# EAGLE design ArduinoFio (EAGLE 7.5.0)
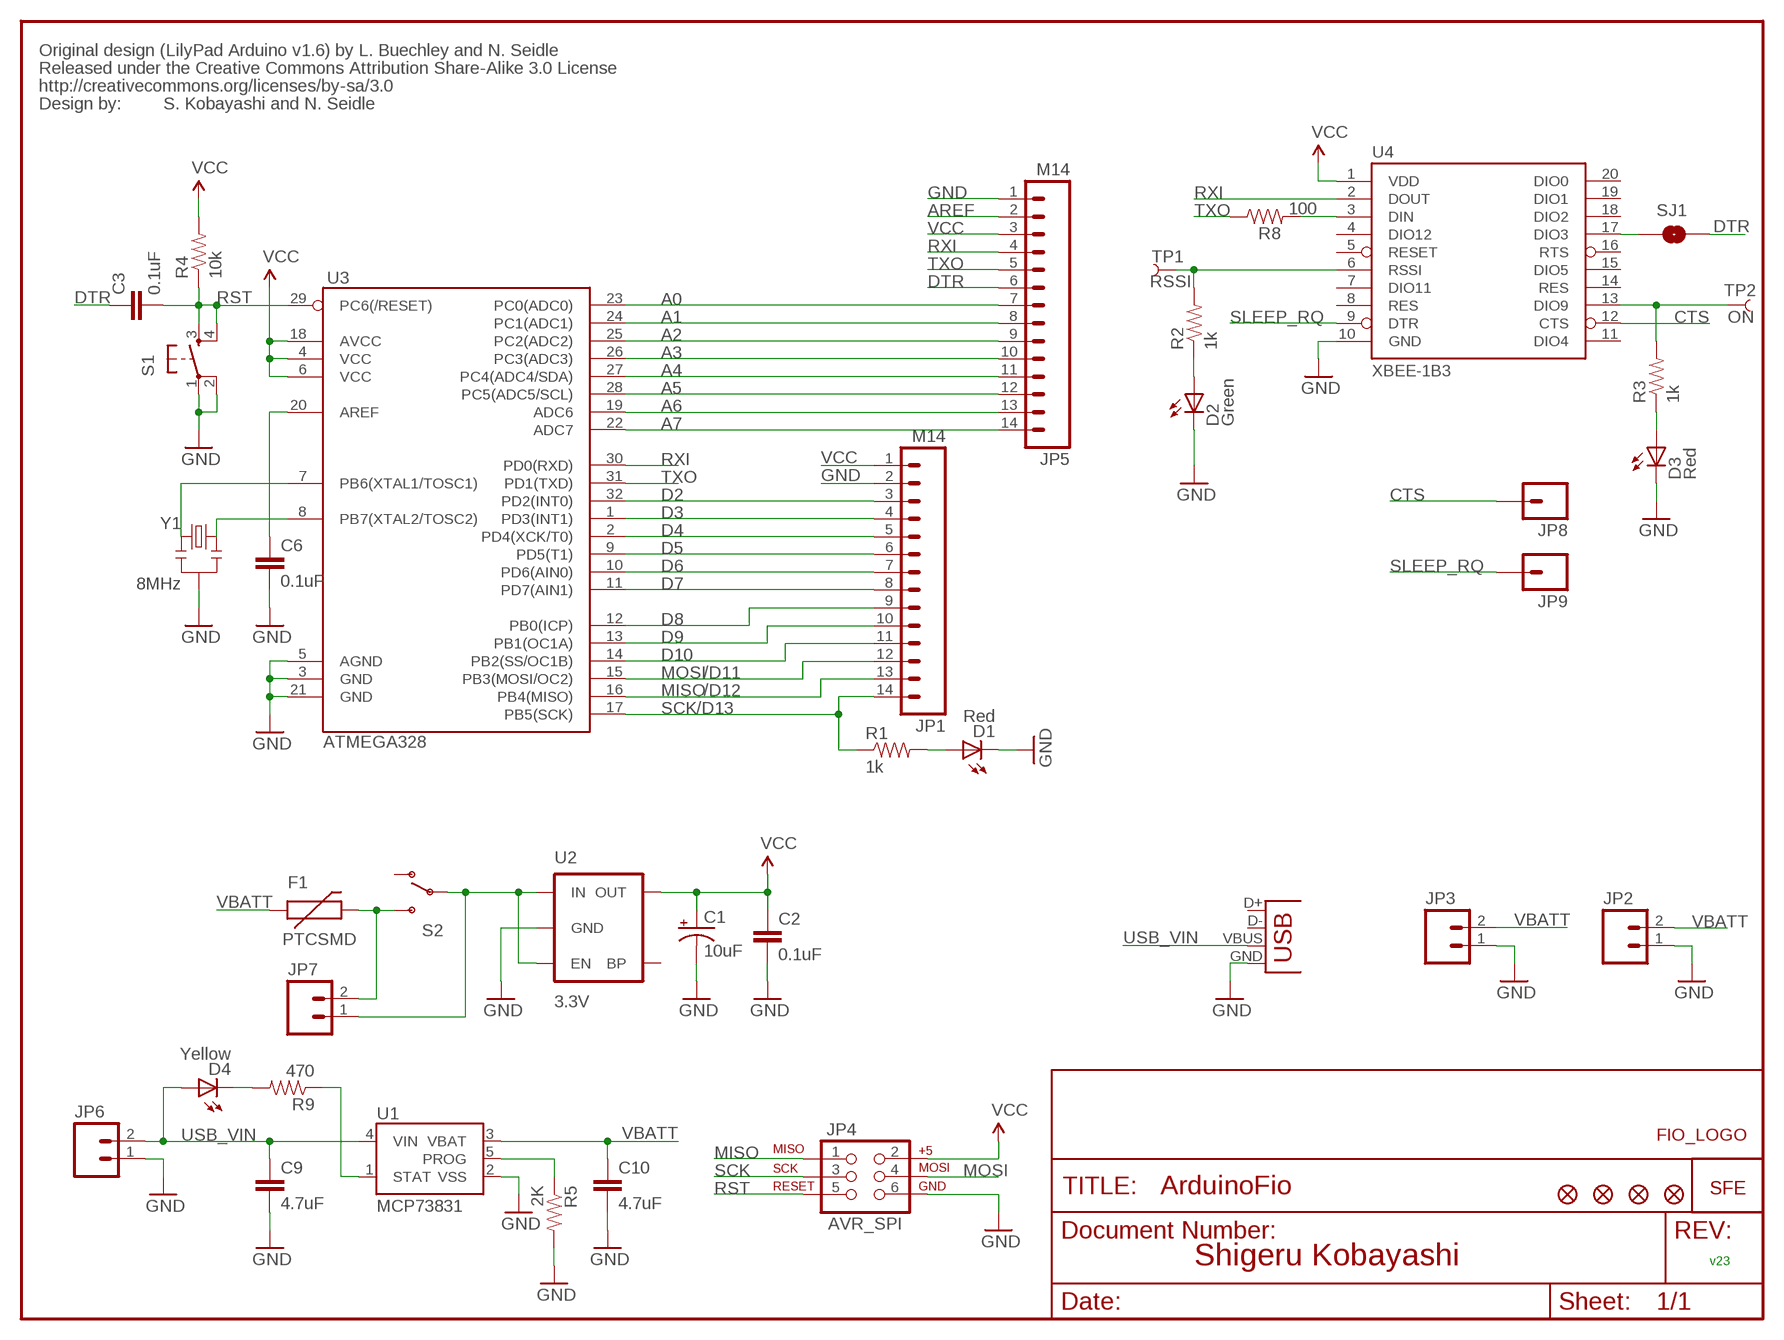
[diagram p0: schematic, sheet 1]

## Parts
C1  10uF  CAP_POL1206  [EIA3216]
C2  0.1uF  CAP0402-CAP  [0402-CAP]
C3  0.1uF  CAP0402-CAP  [0402-CAP]
C6  0.1uF  CAP0402-CAP  [0402-CAP]
C9  4.7uF  CAP0402-CAP  [0402-CAP]
C10  4.7uF  CAP0402-CAP  [0402-CAP]
D1  Red  LED0603  [LED-0603]
D2  Green  LED0603  [LED-0603]
D3  Red  LED0603  [LED-0603]
D4  Yellow  LED0603  [LED-0603]
F1  PTCSMD  [PTC-1206]
FD1  FIDUCIAL1X2  [FIDUCIAL-1X2]
FD2  FIDUCIAL1X2  [FIDUCIAL-1X2]
JP1  M14  [1X14]
JP2  M02PTH  [1X02]
JP3  M02-JST-2MM-SMT  [JST-2-SMD]
JP4  AVR_SPI  AVR_SPI_PRG_6PTH  [2X3]
JP5  M14  [1X14]
JP6  M02PTH  [1X02]
JP7  M02PTH  [1X02]
JP8  M01PTH  [1X01]
JP9  M01PTH  [1X01]
R1  1k  RESISTOR0402-RES  [0402-RES]
R2  1k  RESISTOR0402-RES  [0402-RES]
R3  1k  RESISTOR0402-RES  [0402-RES]
R4  10k  RESISTOR0402-RES  [0402-RES]
R5  2K  RESISTOR0402-RES  [0402-RES]
R8  100  RESISTOR0402-RES  [0402-RES]
R9  470  RESISTOR0402-RES  [0402-RES]
S1  TAC_SWITCHSMD  [TACTILE_SWITCH_SMD]
S2  SWITCH-SPSTSMD  [AYZ0202]
SJ1  SOLDERJUMPERNC  [SJ_2S]
TP1  RSSI  TEST-POINT3X5  [PAD.03X.05]
TP2  ON  TEST-POINT3X5  [PAD.03X.05]
U1  MCP73831  MCP73831SMD  [SOT23-5]
U2  3.3V  V_REG_LDOSMD  [SOT23-5]
U3  ATMEGA328  ATMEGA168  [TQFP32-08]
U4  XBEE-1B3  [XBEE-SMD]
U$1  LOGO-SFENEW  [SFE-NEW-WEBLOGO]
U$3  CREATIVE_COMMONS  [CREATIVE_COMMONS]
U$4  FIDUCIAL1X2  [FIDUCIAL-1X2]
U$5  FIDUCIAL1X2  [FIDUCIAL-1X2]
U$6  FIO_LOGOV2  [FUNNEL_LOGO_BOTTOM_V2]
X1  USBSMD  [USB-MINIB]
Y1  8MHz  RESONATORSMD  [RESONATOR-SMD]

## Nets
A0: JP5.7 U3.23(PC0(ADC0))
A1: JP5.8 U3.24(PC1(ADC1))
A2: JP5.9 U3.25(PC2(ADC2))
A3: JP5.10 U3.26(PC3(ADC3))
A4: JP5.11 U3.27(PC4(ADC4/SDA))
A5: JP5.12 U3.28(PC5(ADC5/SCL))
A6: JP5.13 U3.19(ADC6)
A7: JP5.14 U3.22(ADC7)
AREF: C6.1 JP5.2 U3.20(AREF)
CTS: JP8.1 U4.12(CTS)
D2: JP1.3 U3.32(PD2(INT0))
D3: JP1.4 U3.1(PD3(INT1))
D4: JP1.5 U3.2(PD4(XCK/T0))
D5: JP1.6 U3.9(PD5(T1))
D6: JP1.7 U3.10(PD6(AIN0))
D7: JP1.8 U3.11(PD7(AIN1))
D8: JP1.9 U3.12(PB0(ICP))
D9: JP1.10 U3.13(PB1(OC1A))
D10: JP1.11 U3.14(PB2(SS/OC1B))
DTR: C3.1 JP5.6 SJ1.2
GND: C1.C(-) C2.2 C6.2 C9.2 C10.2 D1.C D2.C D3.C JP1.2 JP2.1 JP3.1 JP4.6 JP5.1 JP6.1 R5.2 S1.1 S1.2 U1.2(VSS) U2.2(GND) U3.3(GND) U3.5(AGND) U3.21(GND) U4.10(GND) X1.GND Y1.2
MISO: JP1.13 JP4.1 U3.16(PB4(MISO))
MOSI: JP1.12 JP4.4 U3.15(PB3(MOSI/OC2))
N$1: R3.2 TP2.P$1 U4.13(DIO9)
N$2: D1.A R1.2
N$3: D2.A R2.1
N$4: R2.2 TP1.P$1 U4.6(RSSI)
N$5: JP7.1 S2.2(P) U2.1(IN) U2.3(EN)
N$6: D3.A R3.1
N$7: R8.2 U4.3(DIN)
N$8: D4.C R9.2
N$9: F1.2 JP7.2 S2.3(S)
N$10: U3.7(PB6(XTAL1/TOSC1)) Y1.3
N$11: R5.1 U1.5(PROG)
N$12: U3.8(PB7(XTAL2/TOSC2)) Y1.1
N$13: SJ1.1 U4.17(DIO3)
N$14: R9.1 U1.1(STAT)
RST: C3.2 JP4.5 R4.1 S1.3 S1.4 U3.29(PC6(/RESET))
RXI: JP5.4 U3.30(PD0(RXD)) U4.2(DOUT)
SCK: JP1.14 JP4.3 R1.1 U3.17(PB5(SCK))
SLEEP_RQ: JP9.1 U4.9(DTR)
TXO: JP5.5 R8.1 U3.31(PD1(TXD))
USB_VIN: C9.1 D4.A JP6.2 U1.4(VIN) X1.VBUS
VBATT: C10.1 F1.1 JP2.2 JP3.2 U1.3(VBAT)
VCC [VCC]: C1.A(+) C2.1 JP1.1 JP4.2 JP5.3 R4.2 U2.5(OUT) U3.4(VCC) U3.6(VCC) U3.18(AVCC) U4.1(VDD)
Unconnected: S2.1(O) U2.4(BP) U4.4(DIO12) U4.5(RESET) U4.7(DIO11) U4.8(RES) U4.11(DIO4) U4.14(RES) U4.15(DIO5) U4.16(RTS) U4.18(DIO2) U4.19(DIO1) U4.20(DIO0) X1.D+ X1.D-

## Notes on the sheet
- Original design (LilyPad Arduino v1.6) by L. Buechley and N. Seidle
- S. Kobayashi and N. Seidle
- /D11
- /D12
- /D13
- Shigeru Kobayashi | v23

## Library data of the parts
C1 = SparkFun:CAP_POL: Capacitor Polarized These are standard SMD and PTH capacitors. Normally 10uF, 47uF, and 100uF in electrolytic and tantalum varieties. Always verify the external diameter of the through hole cap, it varies with capacity, voltage, and manufacturer. The EIA devices should be standard.
C2 C3 C6 C9 C10 = SparkFun:CAP: Capacitor Standard 0603 ceramic capacitor, and 0.1" leaded capacitor.
D1-D4 = SparkFun:LED: LEDs Standard schematic elements and footprints for 5mm, 3mm, 1206, and 0603 sized LEDs. 5mm - Spark Fun Electronics SKU : COM-00529 (and others)
F1 = SparkFun:PTC: Resettable Fuse PTC Resettable Fuse. Spark Fun Electronics SKU : COM-08357
FD1 FD2 = SparkFun-Aesthetics:FIDUCIAL: Fiducial Alignment Points Various fiducial points for machine vision alignment.
JP1 JP5 = SparkFun:M14: Header 14 Standard 14-pin 0.1" header. Use with straight break away headers (SKU : PRT-00116), right angle break away headers (PRT-00553), swiss pins (PRT-00743), machine pins (PRT-00117), and female headers (PRT-00115).
JP2 JP3 JP6 JP7 = SparkFun:M02: Header 2 Standard 2-pin 0.1" header. Use with straight break away headers (SKU : PRT-00116), right angle break away headers (PRT-00553), swiss pins (PRT-00743), machine pins (PRT-00117), and female headers (PRT-00115). Molex polarized connector foot print use with SKU : PRT-08233 with associated crimp pins and housings.
JP4 = SparkFun:AVR_SPI_PRG_6: AVR ISP 6 Pin This is the reduced ISP connector for AVR programming. Common on Arduino. This footprint will take up less PCB space and can be used with a 10-pin to 6-pin adapter such as SKU: BOB-08508
JP8 JP9 = SparkFun:M01: Header 1 Standard 1-pin 0.1" header. Use with straight break away headers (SKU : PRT-00116), right angle break away headers (PRT-00553), swiss pins (PRT-00743), machine pins (PRT-00117), and female headers (PRT-00115).
R1-R5 R8 R9 = SparkFun:RESISTOR: Resistor Basic schematic elements and footprints for 0603, 1206, and PTH resistors.
S1 = SparkFun:TAC_SWITCH: Momentary Switch Button commonly used for reset or general input. Spark Fun Electronics SKU : COM-00097
S2 = SparkFun:SWITCH-SPST: SPST Switch Simple slide switch. Spark Fun Electronics SKU : COM-00102
SJ1 = SparkFun:SOLDERJUMPER: Solder Jumper Standard SMD solder jumper. Used to automate production. Two varients : Normally Open and Normally Closed are the same, but have different paste layers. NC will have a large amount of paste and should jumper during reflow.
TP1 TP2 = SparkFun:TEST-POINT
U1 = SparkFun:MCP73831
U2 = SparkFun:V_REG_LDO: Voltage Regulator LDO Standard 150mA LDO voltage regulator in SOT-23 layout. Micrel part MIC5205. BP (by-pass) pin is used to lower output noise with 470pF cap.
U3 = SparkFun:ATMEGA168
U4 = SparkFun:XBEE-1
U$1 = SparkFun:LOGO-SFE: Spark Fun Electronics PCB Logo This is the standard Spark Fun Electronics PCB logo.
U$3 = SparkFun:CREATIVE_COMMONS
U$4 U$5 = SparkFun:FIDUCIAL: Fiducial Alignment Points Various fiducial points for machine vision alignment.
U$6 = SparkFun:FIO_LOGO
X1 = SparkFun:USB: USB Connectors USB-B-PTH is fully proven SKU : PRT-00139 USB-miniB is fully proven SKU : PRT-00587 USB-A-PCB is untested. USB-A-H is throughly reviewed, but untested. Spark Fun Electronics SKU : PRT-00437 USB-B-SMT is throughly reviewed, but untested. Needs silkscreen touching up. USB-A-S has not been used/tested USB-MB-H has not been used/tested
Y1 = SparkFun:RESONATOR: Resonator Small SMD resonator. This is the itty bitty 10/20MHz resonators with built in caps. CSTCE10M0G55 and CSTCE20M0V53. Footprint has been reviewed closely but hasn't been tested yet.

## Net classes
0 Default: width 0.203 mm
1 VCC: width 0.381 mm
2 LEDPower: width 0.203 mm
3 ButtonSignal: width 0.203 mm

## Board
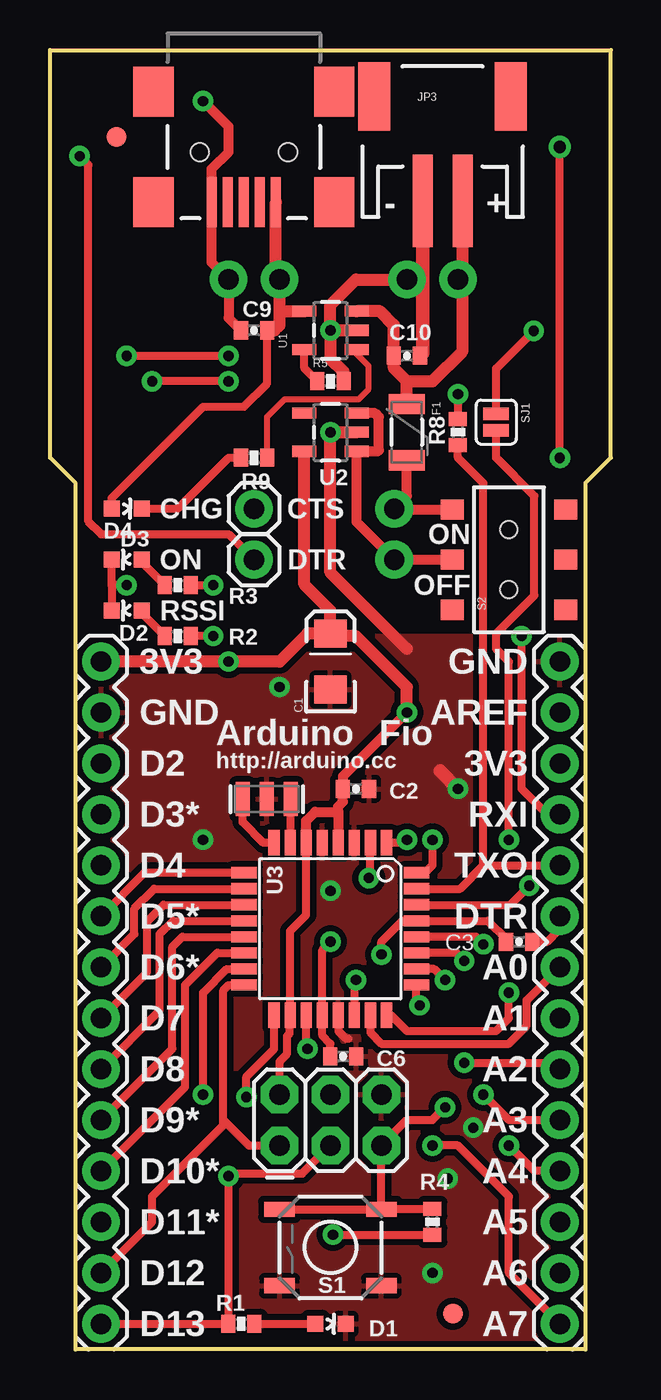
[diagram p1: board, top side]
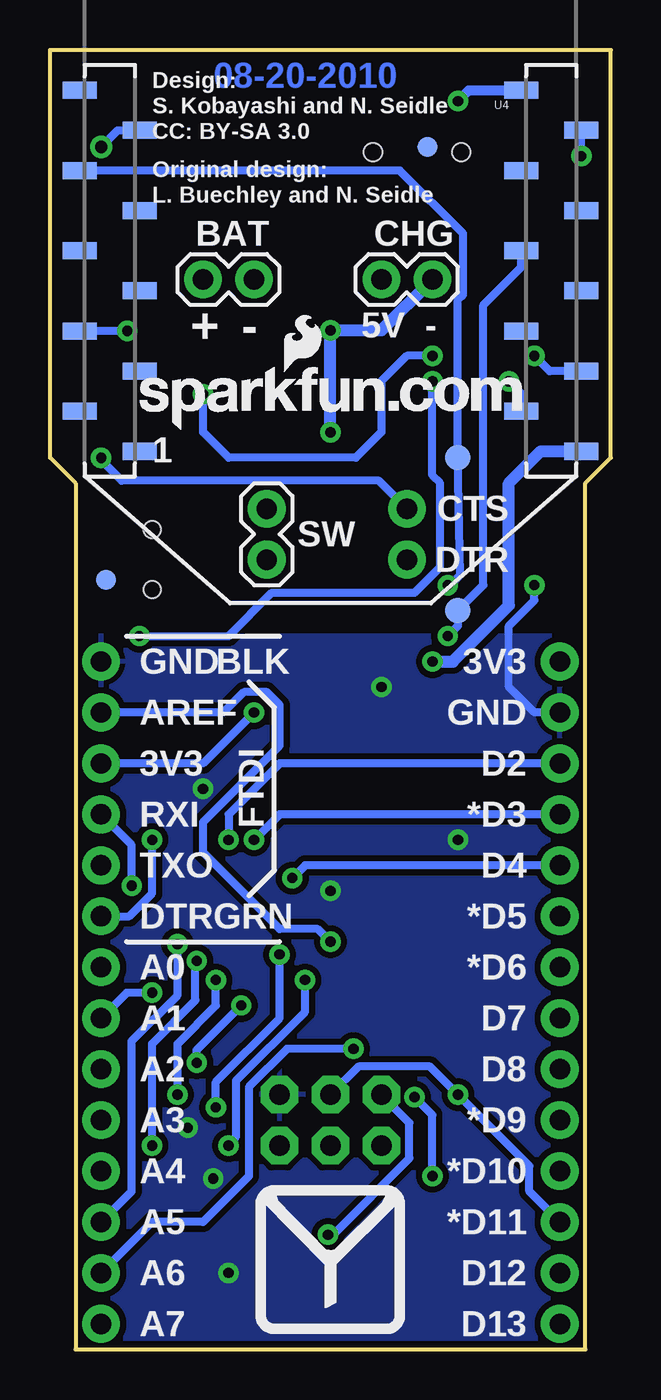
[diagram p2: board, bottom side, seen from below]

Size 27.94 x 64.77 mm. Coordinates in mm from the lower left corner, seen from the top.
Outline: 26.67,43.18 26.67,0 1.27,0 1.27,43.18 0,44.45 0,64.77 27.94,64.77 27.94,44.45 26.67,43.18
Copper layers (1*16): Top 0.035mm / dielectric 1.5mm / Bottom 0.035mm
Design rules "SparkFun": minimum track width 8mil, minimum drill 20mil, track to track 8mil, track to pad 8mil, pad to pad 8mil, via to via 8mil, smd to smd 8mil, copper to edge 8mil, drill to drill 8mil, minimum pad ring 12mil, minimum via ring 10mil, stop-mask expansion 4mil, vias tented up to drill 20mil, thermal gap 10mil

### Footprints (pad centres in the part's own frame; a part is rotated, then mirrored left to right if it is on the bottom)
EIA3216 = smd 1.4 x 1.6: A 1.4,0; C -1.4,0
0402-CAP = smd 0.7 x 0.9: 1 -0.65,0; 2 0.65,0
LED-0603 = smd 0.8 x 0.8: A 0,-0.75; C 0,0.75
PTC-1206 = smd 1 x 1.8: 1 -1.4,0; 2 1.4,0
FIDUCIAL-1X2 = smd 1 x 1: 1 0,0
1X14 = drill 1.016 pad 1.88: 1 0,0; 2 2.54,0; 3 5.08,0; 4 7.62,0; 5 10.16,0; 6 12.7,0; 7 15.24,0; 8 17.78,0; 9 20.32,0; 10 22.86,0; 11 25.4,0; 12 27.94,0; 13 30.48,0; 14 33.02,0
1X02 = drill 1.016 pad 1.88: 1 0,0; 2 2.54,0
JST-2-SMD = smd 1 x 4.6: 1 -1,-3.7; 2 1,-3.7 | smd 1.6 x 3.4: NC1 -3.4,1.5; NC2 3.4,1.5
2X3 = drill 1.016 pad 1.88 octagon: 1 0,0; 2 0,2.54; 3 2.54,0; 4 2.54,2.54; 5 5.08,0; 6 5.08,2.54
1X01 = drill 1.016 pad 1.88: 1 0,0
0402-RES = smd 0.7 x 0.9: 1 -0.65,0; 2 0.65,0
TACTILE_SWITCH_SMD = smd 1.524 x 0.762: 1 -2.54,1.905; 2 2.54,1.905; 3 -2.54,-1.905; 4 2.54,-1.905
AYZ0202 = smd 1 x 1.15: 1 -2.5,2.825; 2 0,2.825; 3 2.5,2.825; 4 -2.5,-2.825; 5 0,-2.825; 6 2.5,-2.825 | hole 0.85: 1.5,0; -1.5,0
SJ_2S = smd 0.635 x 1.27: 1 -0.412,0; 2 0.412,0
PAD.03X.05 = smd 1.27 x 1.27: P$1 0,0
SOT23-5 = smd 0.55 x 1.2: 1 -0.95,-1.3; 2 0,-1.3; 3 0.95,-1.3; 4 0.95,1.3; 5 -0.95,1.3
TQFP32-08 = smd 1.27 x 0.559: 1 -4.293,2.8; 2 -4.293,2; 3 -4.293,1.2; 4 -4.293,0.4; 5 -4.293,-0.4; 6 -4.293,-1.2; 7 -4.293,-2; 8 -4.293,-2.8; 17 4.293,-2.8; 18 4.293,-2; 19 4.293,-1.2; 20 4.293,-0.4; 21 4.293,0.4; 22 4.293,1.2; 23 4.293,2; 24 4.293,2.8 | smd 0.559 x 1.27: 9 -2.8,-4.293; 10 -2,-4.293; 11 -1.2,-4.293; 12 -0.4,-4.293; 13 0.4,-4.293; 14 1.2,-4.293; 15 2,-4.293; 16 2.8,-4.293; 25 2.8,4.293; 26 2,4.293; 27 1.2,4.293; 28 0.4,4.293; 29 -0.4,4.293; 30 -1.2,4.293; 31 -2,4.293; 32 -2.8,4.293
XBEE-SMD = smd 1.7 x 0.85: 1 -12.5,20; 2 -9.5,18; 3 -12.5,16; 4 -9.5,14; 5 -12.5,12; 6 -9.5,10; 7 -12.5,8; 8 -9.5,6; 9 -12.5,4; 10 -9.5,2; 11 12.5,2; 12 9.5,4; 13 12.5,6; 14 9.5,8; 15 12.5,10; 16 9.5,12; 17 12.5,14; 18 9.5,16; 19 12.5,18; 20 9.5,20
USB-MINIB = smd 2.5 x 0.5: D+ 2.5,0; D- 2.5,0.8; GND 2.5,-1.6; ID 2.5,-0.8; VBUS 2.5,1.6 | smd 2.5 x 2: MTN1 -3,4.5; MTN2 2.5,4.5; MTN3 -3,-4.5; MTN4 2.5,-4.5 | hole 0.9: 0,2.2; 0,-2.2
RESONATOR-SMD = smd 0.7 x 1.7: 1 -1.2,0; 2 0,0; 3 1.2,0

### Placement (x,y rotation side)
C1  13.97,34.29 90 top
C2  15.24,27.94 0 top
C3  23.37,20.32 180 top
C6  14.61,14.61 0 top
C9  10.16,50.8 180 top
C10  17.78,49.53 0 top
D1  13.97,1.27 270 top
D2  3.81,36.83 90 top
D3  3.81,39.37 90 top
D4  3.81,41.91 270 top
F1  17.78,45.72 270 top
FD1  25.15,38.35 0 bottom
FD2  9.14,59.94 0 bottom
JP1  2.54,34.29 270 top
JP2  17.78,53.34 180 bottom
JP3  19.56,60.96 0 top
JP4  11.43,10.16 0 top
JP5  25.4,34.29 270 top
JP6  8.89,53.34 180 bottom
JP7  17.14,39.37 90 bottom
JP8  10.16,41.91 0 top
JP9  10.16,39.37 0 top
R1  9.53,1.27 0 top
R2  6.35,35.56 0 top
R3  6.35,38.1 0 top
R4  19.05,6.35 270 top
R5  13.97,48.26 0 top
R8  20.32,45.72 90 top
R9  10.16,44.45 180 top
S1  13.97,5.08 180 top
S2  22.86,39.37 90 top
SJ1  22.22,46.23 270 top
TP1  7.62,36.83 0 bottom
TP2  7.62,44.45 0 bottom
U1  13.97,50.8 90 top
U2  13.97,45.72 90 top
U3  13.96,20.96 270 top
U4  13.97,64.77 180 bottom
U$1  23.5,45.85 0 bottom
U$3  -11.43,-8.89 0 top  (outside the outline)
U$4  20.07,1.78 0 top
U$5  3.3,60.45 0 top
U$6  13.97,4.45 0 top
X1  9.65,59.69 270 top
Y1  10.79,27.43 0 top

### Tracks (layer width: path | path; a pad name or v marks a point on that pad's centre or on a via)
A0
  Top 0.406: U3.23 15.96,15.79 16.51,15.24 22.86,15.24 23.75,16.13 23.75,17.4 JP5.7
A1  (via drill 0.51)
  Top 0.406: U3.24 16.98,16.67 17.78,15.88 22.22,15.88 22.86,16.51 v22.86,17.78
  Bottom 0.406: v22.86,17.78 24.13,17.78 JP5.8
A2  (via drill 0.51)
  Top 0.406: U3.25 18.25,17.31 v18.41,17.14 | v20.64,14.29 25.08,14.29 JP5.9
  Bottom 0.406: v18.41,17.14 20.64,14.92 v20.64,14.29
A3  (via drill 0.51)
  Top 0.406: U3.26 19.13,18.96 v19.68,18.41 | v21.59,12.7 22.86,11.43 JP5.10
  Bottom 0.406: v21.59,12.7 21.59,15.24 19.68,17.14 v19.68,18.41
A4  (via drill 0.51)
  Top 0.406: U3.27 20.24,19.77 v20.64,19.37 | v22.86,10.16 24.13,8.89 JP5.11
  Bottom 0.406: v22.86,10.16 22.86,15.24 20.7,17.4 20.7,19.3 v20.64,19.37
A5  (via drill 0.51)
  Top 0.406: U3.28 21.22,20.57 v21.59,20.19
  Bottom 0.406: v21.59,20.19 21.59,17.65 23.88,15.37 23.88,7.87 JP5.12
A6  (via drill 0.51)
  Top 0.406: U3.19 12.76,14.99 v12.83,14.99
  Bottom 0.406: JP5.13 22.86,6.35 20.32,6.35 18.03,8.64 18.03,13.08 16.13,14.99 v12.83,14.99
A7  (via drill 0.51)
  Top 0.406: U3.22 15.16,18.34 v15.24,18.41 | v19.05,10.16 20.32,10.16 22.86,7.62 22.86,3.81 JP5.14
  Bottom 0.406: v15.24,18.41 15.24,16.83 18.67,13.4 18.67,10.6 19.05,10.22 v19.05,10.16
AREF  (via drill 0.51)
  Top 0.406: C6.1 13.97,15.24 13.56,15.65 U3.20 13.56,19.91 v13.97,20.32
  Bottom 0.406: v13.97,20.32 14.61,20.95 16.51,20.95 20.32,24.77 20.32,26.29 16.51,30.1 16.51,32.13 17.14,32.77 18.29,32.77 19.3,31.75 JP5.2
CTS  (via drill 0.51, 0.6)
  Top 0.406: v25.4,44.45 v25.4,59.94
  Bottom 0.406: U4.12 24.57,60.77 v25.4,59.94 | JP8.1 11.56,43.31 24.38,43.31 25.4,44.32 v25.4,44.45
D2  (via drill 0.51)
  Top 0.406: U3.32 18.68,23.77 19.05,24.13 v19.05,25.4
  Bottom 0.406: v19.05,25.4 19.05,26.67 16.51,29.21 JP1.3
D3  (via drill 0.51)
  Top 0.406: U3.1 17.64,25.26 v17.78,25.4
  Bottom 0.406: v17.78,25.4 16.51,26.67 JP1.4
D4  (via drill 0.51)
  Top 0.406: U3.2 15.96,23.58 v15.88,23.5
  Bottom 0.406: v15.88,23.5 15.24,24.13 JP1.5
D5
  Top 0.406: U3.9 4.71,23.77 JP1.6
D6
  Top 0.406: U3.10 5.19,22.96 4.19,21.97 4.19,20.7 JP1.7
D7
  Top 0.406: U3.11 5.65,22.16 4.83,21.34 4.83,18.8 JP1.8
D8
  Top 0.406: U3.12 6.12,21.36 5.46,20.7 5.46,16.89 JP1.9
D9
  Top 0.406: U3.13 6.6,20.57 6.1,20.07 6.1,14.99 JP1.10
D10
  Top 0.406: JP1.11 6.73,13.08 6.73,18.16 8.34,19.77 U3.14
DTR  (via drill 0.51)
  Top 0.406: C3.1 24.77,20.32 25.4,20.95 JP5.6 | v22.86,25.4 22.86,34.29 22.22,34.92 22.22,35.69 24.13,37.59 24.13,42.55 22.22,44.45 SJ1.2
  Bottom 0.406: JP5.6 24,21.59 22.86,22.73 v22.86,25.4
GND  (via drill 0.51)
  Top 0.406: D2.C 3.05,36.83 3.06,36.84 3.06,38.1 | 3.06,38.1 D3.C | 3.06,38.1 3.05,38.1 | v3.81,38.1 3.06,38.1 | U3.21 14.36,15.87 14.73,15.49 14.86,15.49
  Top 0.508: C9.2 8.89,51.42 JP6.1 8.05,54.18 X1.GND 8.05,58.85 8.89,59.69 8.89,60.96 v7.62,62.23
  Top 0.61: 17.78,34.92 13.97,38.73 v13.97,45.72 U2.2 | 14.61,48.27 R5.2 14.62,48.75 13.97,49.4 v13.97,50.8 | v13.97,50.8 13.97,52.07 15.24,53.34 JP2.1 18.56,53.34 | v13.97,50.8 U1.2
  Top 0.66: v20.32,27.94 19.43,28.83 | C10.2 18.41,49.53 18.56,49.67 18.56,53.34 JP3.1
  Bottom 0.406: JP1.2 3.81,31.75 5.08,33.02 5.08,36.07 3.81,37.34 v3.81,38.1
  Bottom 0.508: U4.10 7.08,62.77 v7.62,62.23
  Bottom 0.61: v13.97,45.72 v13.97,50.8 11.43,50.8 JP6.1
  other vias: 11.43,33.02 19.05,3.81 13.97,22.86 7.62,25.4 19.81,8.51 21.08,11.05
  pour Top (isolate 0.305): 1.27,35.56 26.67,35.56 26.67,0 1.27,0
  pour Bottom (isolate 0.305): 1.27,35.56 26.67,35.56 26.67,0 1.27,0
MISO
  Top 0.406: 10.79,10.16 JP4.1 9.91,10.16 8.64,11.43 | JP1.13 5.08,6.35 5.08,7.62 8.64,11.18 8.64,11.43 | U3.16 8.89,18.16 8.64,17.91 8.64,11.43
MOSI  (via drill 0.51)
  Top 0.406: U3.15 8.8,18.96 7.62,17.78 v7.62,12.7
  Bottom 0.406: JP1.12 4.06,7.87 4.06,9.14 v7.62,12.7 9.02,14.1 12.57,14.1 JP4.4
N$1  (via drill 0.51)
  Top 0.406: R3.2 v8.13,38.1
  Bottom 0.406: U4.13 10.51,58.77 7.37,55.63 7.37,52.58 7.62,52.32 TP2.P$1 7.49,38.61 8,38.1 v8.13,38.1
N$2
  Top 0.406: R1.2 D1.A
N$3
  Top 0.406: D2.A 4.56,36.7 R2.1
N$4  (via drill 0.51)
  Top 0.406: v8.13,35.56 R2.2
  Bottom 0.406: v8.13,35.56 7.62,36.07 TP1.P$1 6.35,38.1 6.35,52.07 4.47,53.95 U4.6
N$5
  Top 0.508: U2.3 16.2,46.67 16.38,46.48 16.38,44.83 16.32,44.77 U2.1 15.27,41.24 JP7.1 S2.2
N$6
  Top 0.406: D3.A 4.56,39.24 R3.1
N$7  (via drill 0.51)
  Top 0.406: v20.32,47.62 R8.2 | v3.81,49.53 v8.89,49.53
  Bottom 0.406: v20.32,47.62 20.32,45.72 19.05,44.45 12.7,44.45 11.43,45.72 11.43,48.26 10.16,49.53 v8.89,49.53 | U4.3 3.05,48.77 v3.81,49.53
N$8
  Top 0.406: R9.2 8.89,44.45 6.35,41.91 D4.C
N$9
  Top 0.508: F1.2 17.78,42.55 JP7.2 17.18,41.87 S2.3
  Top 0.635: F1.2
N$10
  Top 0.406: U3.7 11.99,25.29 Y1.3
N$11
  Top 0.406: U1.5 12.67,48.91 R5.1
N$12
  Top 0.406: Y1.1 9.59,26.28 10.62,25.26 U3.8
N$13  (via drill 0.51)
  Top 0.406: SJ1.1 22.22,48.9 v24.1,50.77
  Bottom 0.406: v24.1,50.77 U4.17
N$14
  Top 0.305: U1.1 15.27,49.63 15.88,49.02 15.88,47.88 15.37,47.37 11.68,47.37 10.81,46.5 R9.1
RST  (via drill 0.51)
  Top 0.406: v16.51,19.68 16.51,20.32 17.55,21.36 U3.29 21.82,21.36 22.72,20.46 C3.2 | S1.4 S1.3 | S1.3 JP4.5 17.78,11.43 19.05,11.43 v19.68,12.06 | S1.3 16.64,6.99 16.65,7 R4.1
  Bottom 0.406: v16.51,19.68 16.51,16.51 19.68,13.34 v19.68,12.06
RXI  (via drill 0.51)
  Top 0.406: v23.5,35.56 23.5,27.94 24.77,26.67 JP5.4 | U3.30 22.93,22.16 v23.88,23.11 | v8.89,48.26 v5.08,48.26
  Bottom 0.406: v23.5,35.56 19.05,35.56 16.89,37.72 9.78,37.72 8.51,38.99 8.51,43.18 8.89,43.56 v8.89,48.26 | JP5.4 23.88,25.15 v23.88,23.11 | U4.2 4.47,47.65 v5.08,48.26
SCK  (via drill 0.51)
  Top 0.406: U3.17 11.16,14.97 9.78,13.59 v9.78,12.57 | JP1.14 R1.1 v8.89,8.64 9.02,8.76 12.57,8.76 JP4.3 13.72,10.16
  Bottom 0.406: v9.78,12.57 8.89,11.68 v8.89,8.64
SLEEP_RQ  (via drill 0.51)
  Top 0.406: v1.47,59.49 1.91,59.05 1.91,41.27 2.54,40.64 8.89,40.64 JP9.1
  Bottom 0.406: v1.47,59.49 U4.9
TXO
  Top 0.406: U3.31 20.43,22.96 21.59,24.13 | 21.59,24.13 JP5.5 | 21.59,24.13 21.59,43.18 20.32,44.45 R8.1
USB_VIN
  Top 0.406: D4.A 3.06,42.43 7.62,46.99 9.65,46.99 10.81,48.15 C9.1
  Top 0.61: X1.VBUS 11.25,53.52 JP6.2 11.43,51.69 | C9.1 11.18,50.8 11.43,51.05 11.43,51.69 | U1.4 11.49,51.75 11.43,51.69
VBATT
  Top 0.254: 20.57,53.34 20.56,53.34 JP2.2
  Top 0.61: JP3.2 20.56,53.34 20.56,49.77 19.05,48.26 17.78,48.26 | F1.1 17.78,48.26 | 17.78,48.26 17.13,48.91 C10.1 17.13,51.07 16.45,51.75 U1.3
VCC  (via drill 0.51)
  Top 0.406: U3.6 12.76,21.65 11.96,20.85 U3.18 11.94,16.65 11.94,15.75 11.81,15.62 11.81,14.73 11.43,14.35 JP4.2 | R4.2 14.11,5.7 v14.1,5.71
  Top 0.508: 14.36,26.8 14.36,27.06 | 14.36,26.8 U3.4 | U3.6 12.76,26.35 13.21,26.8 14.36,26.8 | v17.78,31.75 14.61,28.57 14.61,27.94 | 14.36,27.06 14.35,27.05 | C2.1 14.59,27.29 14.36,27.06
  Top 0.61: U2.5 12.67,38.13 13.97,36.83 C1.A | C1.A 13.97,35.56 15.24,35.56 17.78,33.02 v17.78,31.75 | JP1.1 v8.89,34.29 11.43,34.29 12.83,35.69 C1.A
  Top 0.635: C2.1 14.61,27.94
  Bottom 0.406: JP5.3 20.32,29.21 v17.78,31.75 | v14.1,5.71 13.84,5.71 10.03,9.53 10.03,11.3 JP4.2
  Bottom 0.61: U4.1 3.49,44.77 5.08,43.18 5.08,37.08 7.87,34.29 v8.89,34.29

### Text on the board
Bottom: 08-20-2010
tPlace: - | + | CHG | CTS | ON | ON | DTR | OFF | RSSI | GND | 3V3 | AREF | GND | Arduino | Fio | 3V3 | D2 | http://arduino.cc | RXI | D3* | TXO | D4 | DTR | D5* | A0 | D6* | A1 | D7 | A2 | D8 | A3 | D9* | A4 | D10* | A5 | D11* | A6 | D12 | A7 | D13 | S. Kobayashi and N. Seidle
bPlace: Design: | S. Kobayashi and N. Seidle | CC: BY-SA 3.0 | Original design: | L. Buechley and N. Seidle | CHG | BAT | - | 5V | - | + | 1 | CTS | DTR | SW | 3V3 | BLK | GND | GND | AREF | D2 | FTDI | 3V3 | *D3 | RXI | D4 | TXO | *D5 | GRN | DTR | *D6 | A0 | D7 | A1 | D8 | A2 | *D9 | A3 | *D10 | A4 | *D11 | A5 | D12 | A6 | D13 | A7
Reference: ON | RSSI